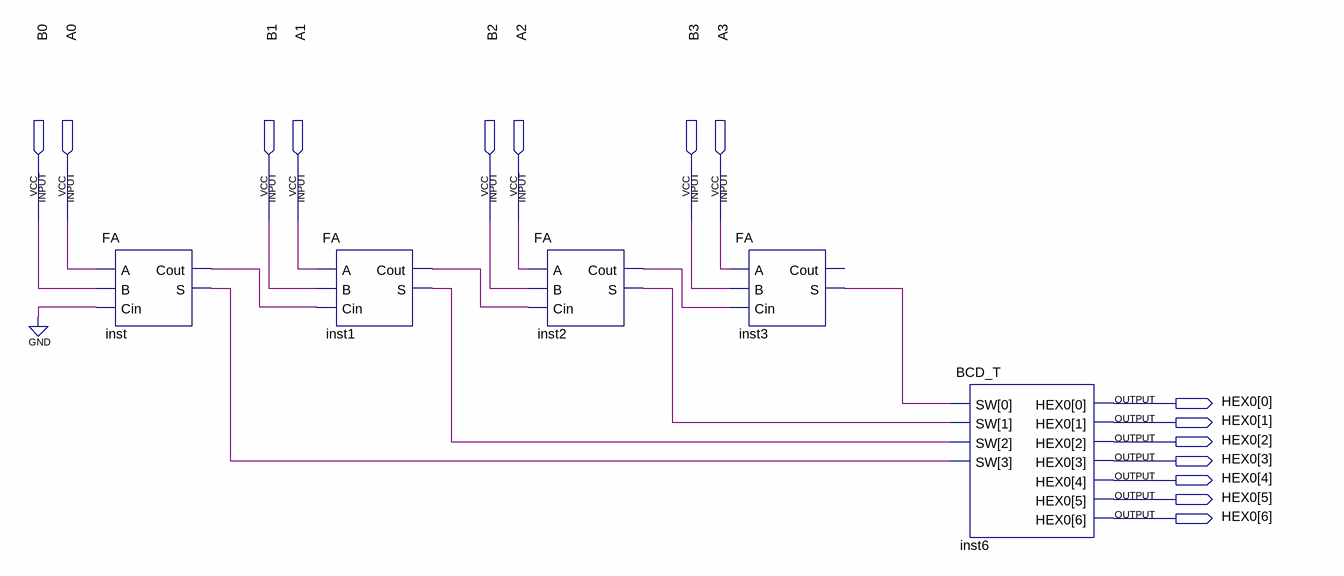
[diagram p0: schematic sheet]
// Quartus schematic FA_4Bit.bdf as structural Verilog: 5 symbols, 15 pins
module FA_4Bit (
  input  B0,
  input  A0,
  input  B1,
  input  A1,
  input  B2,
  input  A2,
  input  B3,
  input  A3,
  output [6:0] HEX0
);

  wire inst1_cout, inst1_s, inst2_cout, inst2_s, inst3_s, inst_cout, inst_s;

  FA inst (.A(A0), .B(B0), .Cin(1'b0), .Cout(inst_cout), .S(inst_s));
  FA inst1 (.A(A1), .B(B1), .Cin(inst_cout), .Cout(inst1_cout), .S(inst1_s));
  FA inst2 (.A(A2), .B(B2), .Cin(inst1_cout), .Cout(inst2_cout), .S(inst2_s));
  FA inst3 (.A(A3), .B(B3), .Cin(inst2_cout), .S(inst3_s));  // open: Cout
  BCD_T inst6 (.SW({inst_s, inst1_s, inst2_s, inst3_s}), .HEX0(HEX0));
endmodule
